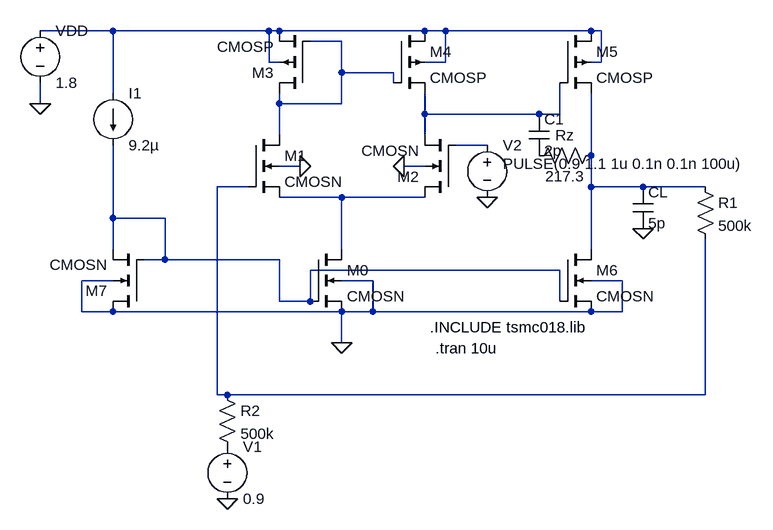
[diagram p0: schematic OTA_CLOSED_LOOP.asc]
OTA_CLOSED_LOOP.asc, the LTspice schematic file:
Version 4
SHEET 1 1064 724
WIRE -96 -16 -208 -16
WIRE 144 -16 -96 -16
WIRE 160 -16 144 -16
WIRE 384 -16 160 -16
WIRE 416 -16 384 -16
WIRE 640 -16 416 -16
WIRE 656 -16 640 -16
WIRE 256 0 208 0
WIRE 144 32 144 -16
WIRE 160 32 144 32
WIRE 416 32 416 -16
WIRE 416 32 384 32
WIRE 656 32 656 -16
WIRE 656 32 640 32
WIRE 256 48 256 0
WIRE 336 48 256 48
WIRE 336 64 336 48
WIRE -96 80 -96 -16
WIRE -208 96 -208 64
WIRE 160 96 160 80
WIRE 256 96 256 48
WIRE 256 96 160 96
WIRE 384 112 384 80
WIRE 560 112 384 112
WIRE 592 112 592 64
WIRE 592 112 560 112
WIRE 160 144 160 96
WIRE 384 144 384 112
WIRE 480 160 432 160
WIRE 640 176 640 80
WIRE 192 192 160 192
WIRE 384 192 352 192
WIRE 112 224 64 224
WIRE 640 224 640 176
WIRE 720 224 640 224
WIRE 816 224 720 224
WIRE 256 240 160 240
WIRE 384 240 256 240
WIRE -96 272 -96 160
WIRE -16 272 -96 272
WIRE -96 320 -96 272
WIRE 256 320 256 240
WIRE 640 320 640 224
WIRE -16 336 -16 272
WIRE -16 336 -48 336
WIRE 160 336 -16 336
WIRE 592 352 208 352
WIRE -96 368 -144 368
WIRE 304 368 256 368
WIRE 688 368 640 368
WIRE 160 400 160 336
WIRE 208 400 208 352
WIRE 208 400 160 400
WIRE 592 400 592 352
WIRE -144 416 -144 368
WIRE -96 416 -144 416
WIRE 256 416 -96 416
WIRE 304 416 304 368
WIRE 304 416 256 416
WIRE 640 416 304 416
WIRE 688 416 688 368
WIRE 688 416 640 416
WIRE 256 464 256 416
WIRE 64 544 64 224
WIRE 80 544 64 544
WIRE 816 544 816 304
WIRE 816 544 80 544
FLAG -208 96 0
FLAG 256 464 0
FLAG 720 288 0
FLAG 480 240 0
FLAG 192 192 0
FLAG 352 192 0
FLAG 80 704 0
SYMBOL current -96 80 R0
WINDOW 123 0 0 Left 2
WINDOW 39 0 0 Left 2
SYMATTR InstName I1
SYMATTR Value 9.2µ
SYMBOL voltage -208 -32 R0
WINDOW 123 0 0 Left 2
WINDOW 39 0 0 Left 2
SYMATTR InstName VDD
SYMATTR Value 1.8
SYMBOL cmosn 112 144 R0
SYMATTR InstName M1
SYMATTR Value2 l=0.5u w=5u
SYMBOL cmosn 432 240 R180
SYMATTR InstName M2
SYMATTR Value2 l=0.5u w=5u
SYMBOL cmosn -48 416 R180
SYMATTR InstName M7
SYMATTR Value2 l=0.5u w=1u
SYMBOL cmosn 208 320 R0
SYMATTR InstName M0
SYMATTR Value2 l=0.5u w=10u
SYMBOL cmosn 592 320 R0
SYMATTR InstName M6
SYMATTR Value2 l=0.5u w=50u
SYMBOL cmosp 208 80 R180
SYMATTR InstName M3
SYMATTR Value2 l=0.5u w=11.5u
SYMBOL cmosp 336 -16 R0
SYMATTR InstName M4
SYMATTR Value2 l=0.5u w=11.5u
SYMBOL cmosp 592 -16 R0
SYMATTR InstName M5
SYMATTR Value2 l=0.5u w=115u
SYMBOL cap 704 224 R0
SYMATTR InstName CL
SYMATTR Value 5p
SYMBOL voltage 480 144 R0
WINDOW 123 24 124 Left 2
WINDOW 39 0 0 Left 2
WINDOW 3 24 44 Left 2
SYMATTR Value PULSE(0.9 1.1 1u 0.1n 0.1n 100u)
SYMATTR InstName V2
SYMBOL cap 544 112 R0
SYMATTR InstName C1
SYMATTR Value 2p
SYMBOL res 656 160 R90
WINDOW 0 0 56 VBottom 2
WINDOW 3 32 56 VTop 2
SYMATTR InstName Rz
SYMATTR Value 217.3
SYMBOL voltage 80 608 R0
WINDOW 123 0 0 Left 2
WINDOW 39 0 0 Left 2
SYMATTR InstName V1
SYMATTR Value 0.9
SYMBOL res 800 208 R0
SYMATTR InstName R1
SYMATTR Value 500k
SYMBOL res 64 528 R0
SYMATTR InstName R2
SYMATTR Value 500k
TEXT 392 440 Left 2 !.INCLUDE tsmc018.lib
TEXT 400 472 Left 2 !.tran 10u

The netlist it stands for:
* OTA_CLOSED_LOOP.asc
I1 N001 N008 9.2µ
VDD N001 0 1.8
M1 N002 N006 N007 0 CMOSN l=0.5u w=5u
M2 N007 N004 N003 0 CMOSN l=0.5u w=5u
M7 0 N008 N008 0 CMOSN l=0.5u w=1u
M0 N007 N008 0 0 CMOSN l=0.5u w=10u
M6 N005 N008 0 0 CMOSN l=0.5u w=50u
M3 N002 N002 N001 N001 CMOSP l=0.5u w=11.5u
M4 N001 N002 N003 N001 CMOSP l=0.5u w=11.5u
M5 N001 N003 N005 N001 CMOSP l=0.5u w=115u
CL N005 0 5p
V2 N004 0 PULSE(0.9 1.1 1u 0.1n 0.1n 100u)
C1 N003 P001 2p
Rz N005 P001 217.3
V1 P002 0 0.9
R1 N005 N006 500k
R2 N006 P002 500k
.model NMOS NMOS
.model PMOS PMOS
.lib standard.mos
.INCLUDE tsmc018.lib
.tran 10u
.backanno
.end